# EasyEDA Pro project 鱼缸控制器(e-ink).epro, schematic 控制板原理图
Create Date: 2024-04-12; Page Name: P1; Project Name: 鱼缸控制器(e-ink); Schematic Name: 控制板原理图; Update Date: 2024-05-07; Company: 嘉立创EDA; Page Size: A2; Version: V1.0
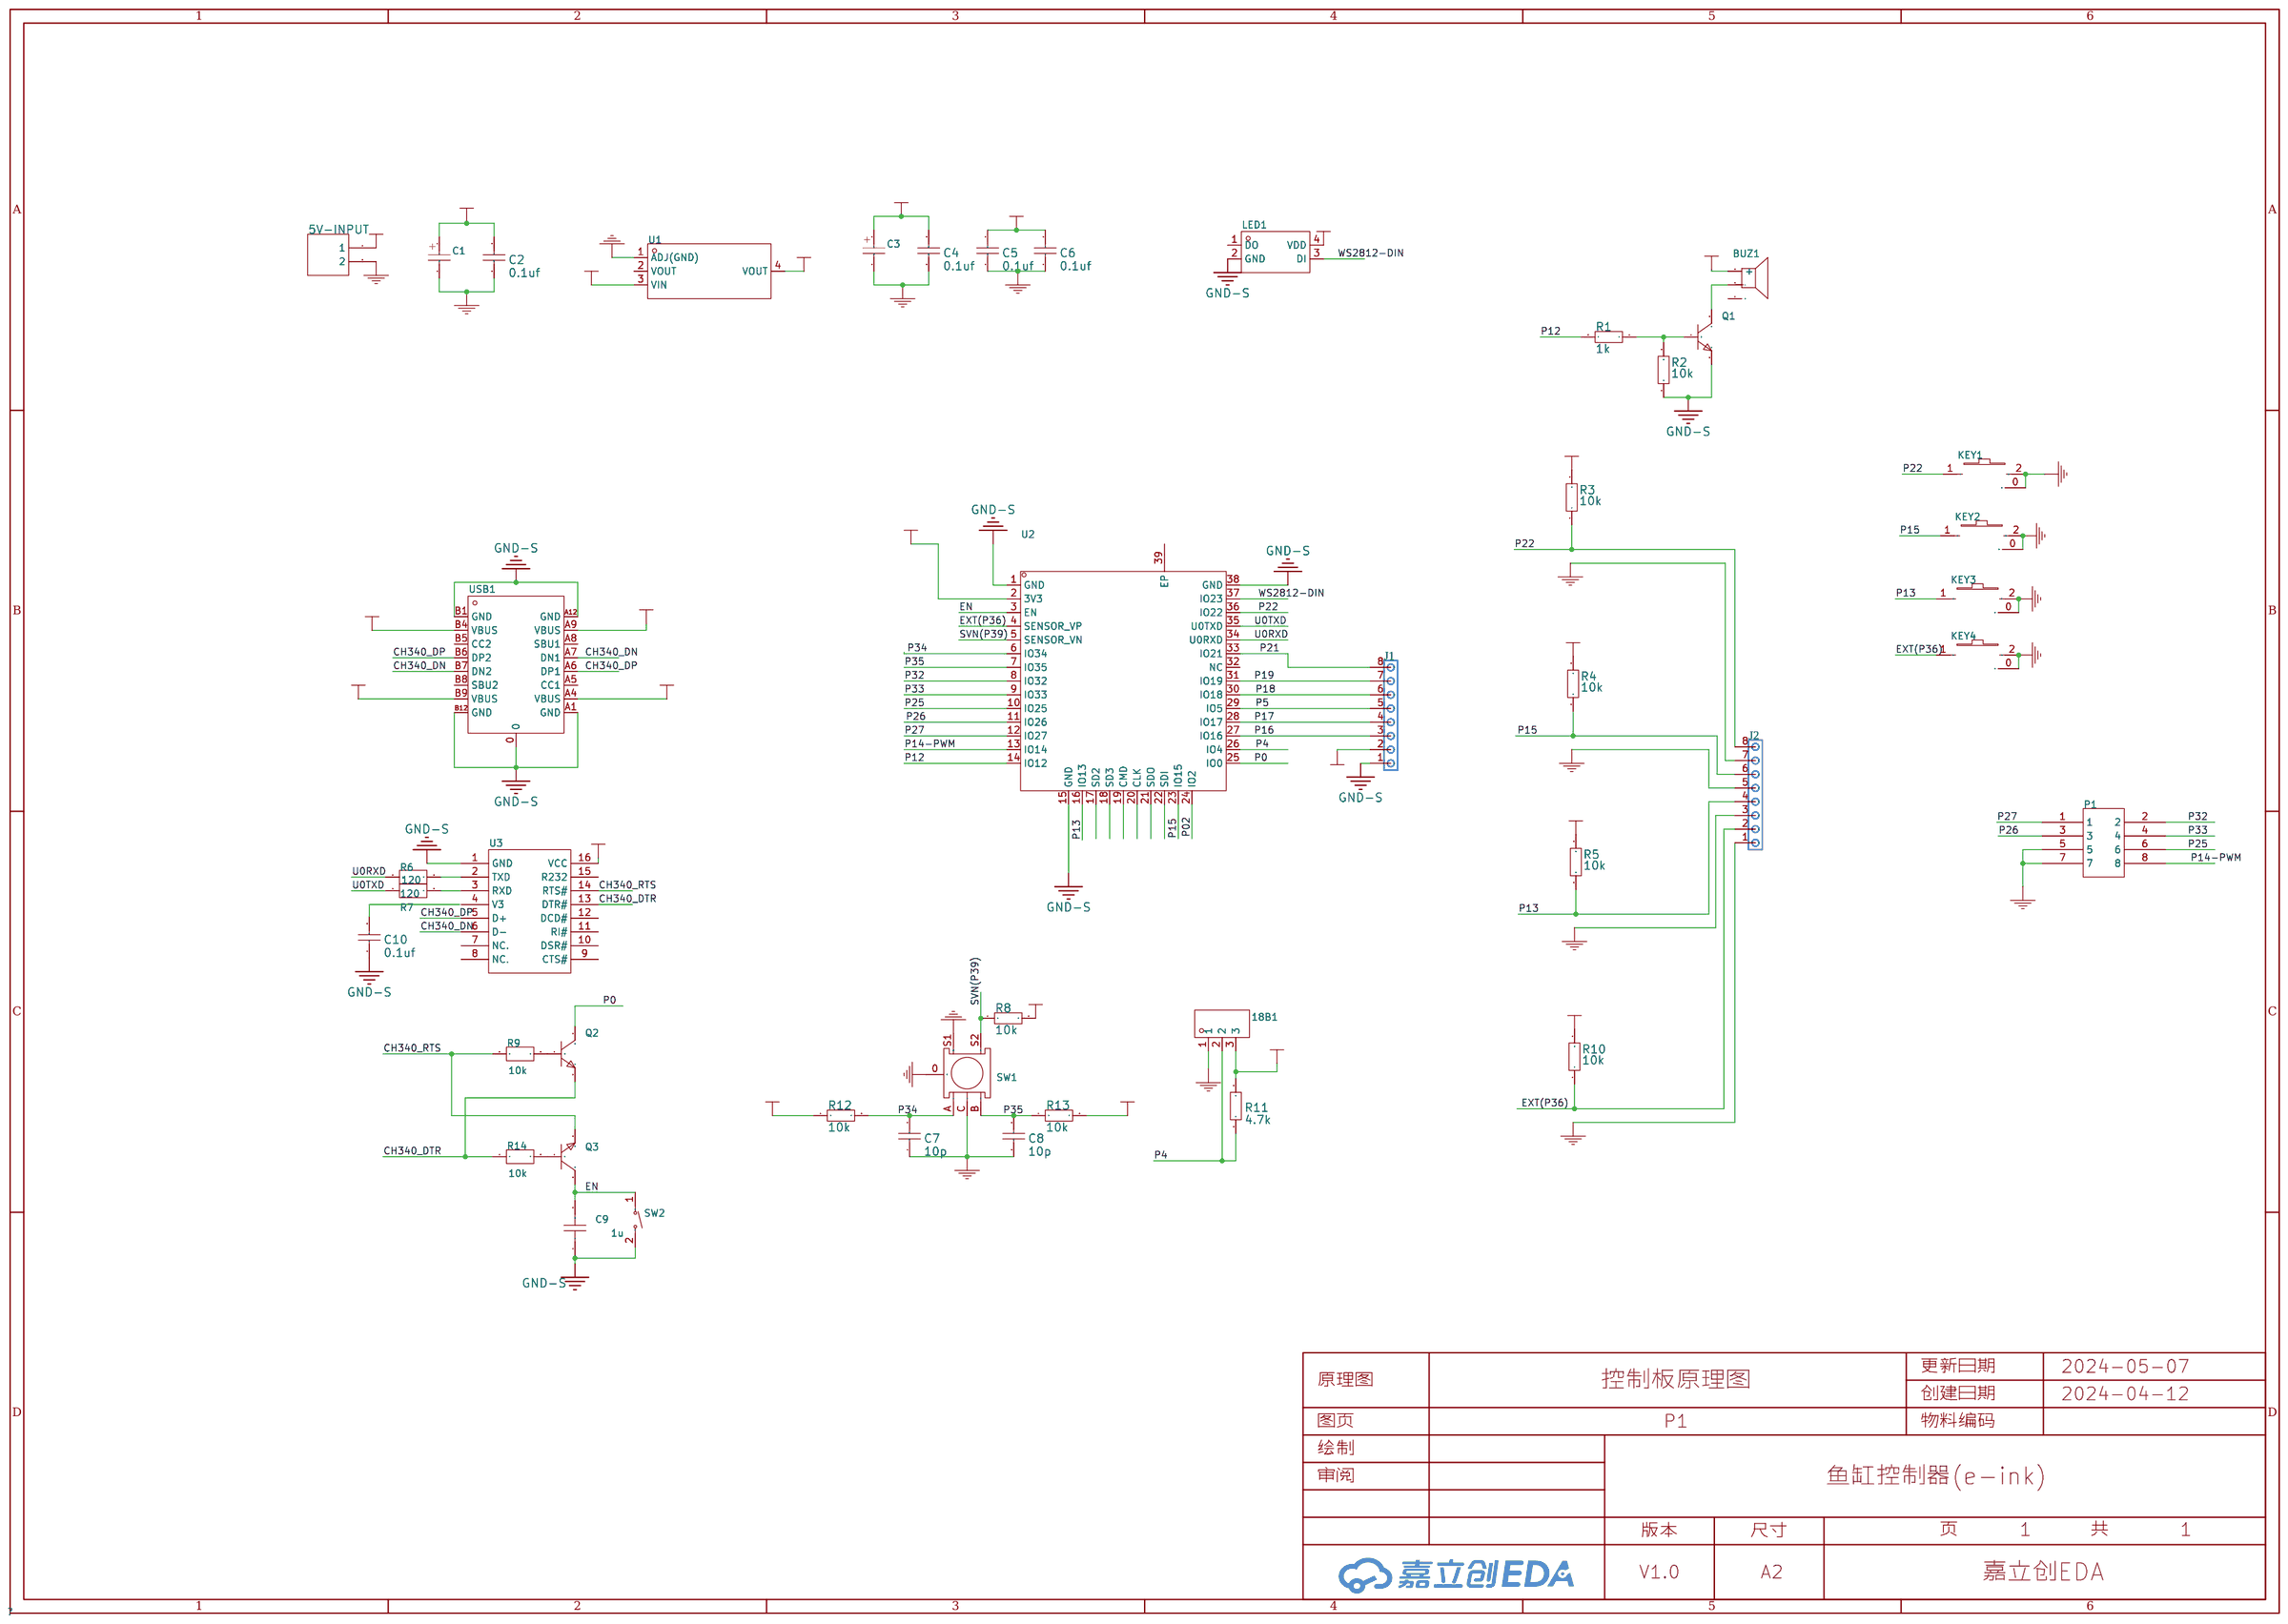
[diagram p1: schematic sheet]

## Parts
5V-INPUT  SIP2  [conn-th_xh2.54-2p]
18B1  3PIN白色直针插座  [CONN-TH_3P-P2.50_3PIN]
BUZ1  5025贴片蜂鸣器  [BUZ-SMD_3P-L5.5-W5.0_5025]
C1  10uF  [CAP-SMD-钽_3216]
C2  0.1uf  [C0805]
C3  10uF  [CAP-SMD-钽_3216]
C4  0.1uf  [C0805]
C5  0.1uf  [C0805]
C6  0.1uf  [C0805]
C7  10p  [C0805]
C8  10p  [C0805]
C9  10uF  [C0805]
C10  0.1uf  [C0805]
J1  单排排针  [CONN-SMD_8P-P1.25_XUNPU_WAFER-MX1.25-8PWB]
J2  单排排针  [CONN-SMD_8P-P1.25_XUNPU_WAFER-MX1.25-8PWB]
KEY1  6*6*4.3 带支架 260g  [KEY-TH_TL1105VF100Q]
KEY2  6*6*4.3 带支架 260g  [KEY-TH_TL1105VF100Q]
KEY3  6*6*4.3 带支架 260g  [KEY-TH_TL1105VF100Q]
KEY4  6*6*4.3 带支架 260g  [KEY-TH_TL1105VF100Q]
LED1  WS2812B-2020  [LED-SMD_4P-L2.0-W2.0-TL_WS2812B-2020]
P1  DC3-8P  [DC3-8P]
Q1  -  [SOT-23-3_L2.9-W1.3-P1.90-LS2.4-BR]
Q2  -  [SOT-23-3_L2.9-W1.3-P1.90-LS2.4-BR]
Q3  -  [SOT-23-3_L2.9-W1.3-P1.90-LS2.4-BR]
R1  1k  [R0805]
R2  10k  [R0805]
R3  10k  [R0805]
R4  10k  [R0805]
R5  10k  [R0805]
R6  120R  [R0805]
R7  120R  [R0805]
R8  10k  [R0805]
R9  10k  [R0805]
R10  10k  [R0805]
R11  4.7k  [R0805]
R12  10k  [R0805]
R13  10k  [R0805]
R14  10k  [R0805]
SW1  EC11S  [SW-TH_EC11S]
SW2  BUTTON2,KEY  [KEY-SMD_L6.0-W3.5-LS8.0]
U1  AMS1117-3.3  [SOT-223-3_L6.5-W3.4-P2.30-LS7.0-BR]
U2  -  [wifim-smd_esp-32s]
U3  -  [SOP-16_L10.0-W3.9-P1.27-LS6.0-BL]
USB1  -  [USB-C_SMD-TYPE-C-31-M-12]

## Library data of the parts
5V-INPUT = SIP2: Manufacturer Part: ?
18B1 = 3PIN白色直针插座: Supplier Part: C9900004958; Supplier Footprint: XH2.54MM; JLCPCB Part Class: 扩展库; Supplier: LCSC
BUZ1 = 5025贴片蜂鸣器: Supplier Part: C9900027059; Supplier Footprint: BUZ-SMD; JLCPCB Part Class: 扩展库; Supplier: LCSC
C1 C3 = 钽电容_3216_A: 容值:10uF;精度:±10%;额定电压:16V;等效串联电阻:3Ω@100kHz;工作温度:-55℃~+125℃;; LCSC Part Name: 10uF ±10% 16V; Supplier Part: C7171; Manufacturer: Kyocera AVX; Manufacturer Part: TAJA106K016RNJ; Supplier Footprint: CASE-A-3216; JLCPCB Part Class: 基础库; Datasheet: https://atta.szlcsc.com/upload/public/pdf/source/20160107/1457707748093.pdf; Supplier: LCSC; Tolerance: ±10%; Rated Voltage: 16V; Equivalent Series Resistance(ESR): 3Ω@100kHz; Operating Temperature: -55℃~+125℃
C2 C4-C8 C10 = 1uf: Capacitor; Manufacturer Part: ?
C9 = CC0805KKX7R7BB106: 容值:10uF;精度:±10%;额定电压:16V;温度系数:X7R;; LCSC Part Name: 10uF ±10% 16V; Supplier Part: C326595; Manufacturer: YAGEO(国巨); LCSC On Sale: 1; Supplier Footprint: 0805; JLCPCB On Sale: 1; Datasheet: https://atta.szlcsc.com/upload/public/pdf/source/20181031/C326595_C62C116A6C3064E30600AA088F316586.pdf; Supplier: LCSC; Tolerance: ±10%; Voltage Rated: 16V; Temperature Coefficient: X7R; JLCPCB Part Class: Extended Part
J1 J2 = 单排排针: 8P接插件; 通识封装: 排针 8P; Origin Footprint 2: HDR-1X8; Origin Footprint 3: HDR-1X8_M; Origin Footprint 4: XH2.54-8P; Origin Footprint 5: VH3.96-8P_H; Origin Footprint 6: VH3.96-8P; Origin Footprint 7: KF2510-8P; Origin Footprint 8: XH2.54-8P_H; Origin Footprint 9: HDR-1X8_Y; Origin Footprint 10: HDR-1X8_H; Origin Footprint 11: KF301-8P; Origin Footprint 12: KF2EDGK5.0-8P; Origin Footprint 13: PH2.0 D-L-8P; Origin Footprint 14: PH2.0 D-W-8P; Origin Footprint 15: KF2EDGK5.0-8P_H; Origin Footprint 16: KF7620-8P; Origin Footprint 17: KF350-8P; Origin Footprint 18: KF128-3.81-8P; Origin Footprint 19: KF128-5.08-8P; Origin Footprint 20: PH2.0 S-W-8P; Origin Footprint 21: KF2EDGK5.08-8P; Origin Footprint 22: KF2EDGK5.08-8P_H; Origin Footprint 23: HDR2.54 S-W-8P; Origin Footprint 24: HDR2.54 S-W-8P_M; Origin Footprint 25: HDR-1X8(Pad_RR_1.4*1.6); Origin Footprint 1: J_排针_2.54_8x1P_SMD_卧贴; Design Item ID: J_Header_8; Library Name: 10.1 排针、排母
KEY1-KEY4 = 6*6*4.3 带支架 260g: LCSC Part Name: 6*6*4.3 带支架  260g; Supplier Part: C3683; Supplier Footprint: 插件; JLCPCB Part Class: 扩展库; Supplier: LCSC
LED1 = WS2812B-2020: 发光颜色:RGB三色;二极管配置:-;透镜颜色:-;主波长:470.4nm；622.5nm；515.6nm;峰值波长:-;色温:-;测试电流:12mA;功率:-;发光角度:-;安装方式:-;工作温度:-;; LCSC Part Name: RGB三色 470.4nm 515.6nm 622.5nm （注意防潮，请查阅规格书中对应具体内容）; Supplier Part: C965555; Manufacturer: worldsemi; Supplier Footprint: SMD,2x2mm; JLCPCB Part Class: Extended Part; Datasheet: https://atta.szlcsc.com/upload/public/pdf/source/20201203/C965555_5C919C4B6231E6ADE06011FB0D94282B.pdf; Supplier: LCSC; Emitted Color: RGB三色; Dominant Wavelength: 470.4nm；622.5nm；515.6nm; Forward Current: 12mA
P1 = DC3-8P: _: 3
Q1-Q3 = SS8050_C2898656: LCSC Part Name: SS8050; Supplier Part: C2898656; Manufacturer: YFW佑风微; Manufacturer Part: SS8050; LCSC On Sale: 1; Supplier Footprint: SOT-23; JLCPCB On Sale: 0; Datasheet: https://atta.szlcsc.com/upload/public/pdf/source/20211008/622629BC07A9A4119D4C274AF7AE621D.pdf; Supplier: LCSC; JLCPCB Part Class: Extended Part
R1-R5 R10 = 4k7: Manufacturer Part: ?
R6 R7 R9 R14 = PTFR0805B232RP9: LCSC Part Name: 232 ±0.1%; Supplier Part: C2849113; Manufacturer: RESI(开步睿思）; LCSC On Sale: 1; Supplier Footprint: 0805; JLCPCB On Sale: 1; Datasheet: https://atta.szlcsc.com/upload/public/pdf/source/20210312/C2692860_0B6649DBA3C867366D8AF92C78953B08.pdf; Supplier: LCSC; JLCPCB Part Class: Extended Part
R8 R12 R13 = 10k: Manufacturer Part: ?
R11 = 4.7k: Manufacturer Part: ?
SW1 = EC11S: Supplier Part: C2895684; Supplier Footprint: 插件; JLCPCB Part Class: 扩展库; Supplier: LCSC
SW2 = BUTTON2,KEY: Supplier Part: C9900020455; JLCPCB Part Class: 扩展库; Supplier: LCSC
U1 = AMS1117-3.3: 输出类型:固定;最大输入电压:18V;输出电压:3.3V;最大输出电流:1A;电源纹波抑制比(PSRR):60dB@(120Hz);输出极性:正极;; LCSC Part Name: 输入18V 输出3.3V 1A; Supplier Part: C2891839; Manufacturer: YONGYUTAI(永裕泰); Supplier Footprint: SOT-223-3; JLCPCB Part Class: 扩展库; Datasheet: https://atta.szlcsc.com/upload/public/pdf/source/20210901/A75ADDE6A17DEE0002F2A58A8D1F3634.pdf; Supplier: LCSC; Output Type: 固定; Maximum Input Voltage: 18V; Output Voltage: 3.3V; MAX Output Current: 1A; Power Supply Rejection Ratio (PSRR): 60dB@(120Hz); Dropout Voltage: 1.3V@(1A); standby current: 5mA; Noise: 0.005%Vout; Operating Temperature: -40℃~+125℃@(Tj); Output Polarity: 正极; Number of Outputs: 1
U2 = ESP32-S_1: LCSC Part Name: ESP32-S; Supplier Part: C277944; Manufacturer: Ai-Thinker(安信可); Manufacturer Part: ESP32-S; LCSC On Sale: 1; Supplier Footprint: SMD Module; JLCPCB On Sale: 1; Datasheet: https://atta.szlcsc.com/upload/public/pdf/source/20180906/C277944_74A290DBC2785A9356A78158C15DB62B.pdf; Supplier: LCSC; JLCPCB Part Class: Extended Part
U3 = CH340C: 类型:Transceiver;协议类别:USB 2.0;驱动器/接收器数:-;数据速率:2Mbps;; Supplier Part: C84681; Manufacturer: WCH(南京沁恒); LCSC On Sale: 1; Supplier Footprint: SOP-16_150mil; JLCPCB On Sale: 1; Datasheet: https://atta.szlcsc.com/upload/public/pdf/source/20200819/C84681_ADBED554CE321879DBD6B1D06488689C.pdf; Supplier: LCSC; Type: Transceiver; Protocol: USB 2.0; Data Rate: 2Mbps; Supply Voltage: 3.3V, 5V; JLCPCB Part Class: Extended Part
USB1 = USB-TYPE-C-018: Supplier Part: C2927038; Manufacturer: DEALON(德艺隆); LCSC On Sale: 1; Supplier Footprint: 插件; JLCPCB On Sale: 0; Datasheet: https://atta.szlcsc.com/upload/public/pdf/source/20211217/CCD3D517E355E8E0CC52ABD8D5784AD8.pdf; Supplier: LCSC

## Nets
+3.3V: 18B1.3 C3.1 C4.2 C5.2 C6.2 J1.2 R3.2 R4.2 R5.2 R8.2 R10.2 R11.2 R12.1 R13.2 U1.4(VOUT) U2.2(3V3) U3.16(VCC)
+5V: 5V-INPUT.1 BUZ1.2(+) C1.1 C2.2 LED1.4(VDD) U1.3(VIN) USB1.A4(VBUS) USB1.A9(VBUS) USB1.B4(VBUS) USB1.B9(VBUS)
GND-S: 5V-INPUT.2 18B1.1 C1.2 C2.1 C3.2 C4.1 C5.1 C6.1 C7.1 C8.1 C9.1 C10.1 J1.1 J2.1 J2.3 J2.5 J2.7 KEY1.0 KEY1.2 KEY2.0 KEY2.2 KEY3.0 KEY3.2 KEY4.0 KEY4.2 LED1.2(GND) P1.5 P1.7 Q1.2(E) R2.1 SW1.0 SW1.C SW1.S1 SW2.2 U1.1(ADJ(GND)) U2.1(GND) U2.15(GND) U2.38(GND) U3.1(GND) USB1.0 USB1.A1(GND) USB1.A12(GND) USB1.B1(GND) USB1.B12(GND)
CH340_DN: U3.6(D-) USB1.A7(DN1) USB1.B7(DN2)
CH340_DP: U3.5(D+) USB1.A6(DP1) USB1.B6(DP2)
CH340_DTR: Q2.2(E) R14.1 U3.13(DTR#)
CH340_RTS: Q3.2(E) R9.1 U3.14(RTS#)
EN: C9.2 Q3.3(C) SW2.1 U2.3(EN)
EXT(P36): J2.2 KEY4.1 R10.1 U2.4(SENSOR_VP)
P0: Q2.3(C) U2.25(IO0)
P02: U2.24(IO2)
P4: 18B1.2 R11.1 U2.26(IO4)
P5: J1.5 U2.29(IO5)
P12: R1.2 U2.14(IO12)
P13: J2.4 KEY3.1 R5.1 U2.16(IO13)
P14-PWM: P1.8 U2.13(IO14)
P15: J2.6 KEY2.1 R4.1 U2.23(IO15)
P16: J1.3 U2.27(IO16)
P17: J1.4 U2.28(IO17)
P18: J1.6 U2.30(IO18)
P19: J1.7 U2.31(IO19)
P21: J1.8 U2.33(IO21)
P22: J2.8 KEY1.1 R3.1 U2.36(IO22)
P25: P1.6 U2.10(IO25)
P26: P1.3 U2.11(IO26)
P27: P1.1 U2.12(IO27)
P32: P1.2 U2.8(IO32)
P33: P1.4 U2.9(IO33)
P34: C7.2 R12.2 SW1.A U2.6(IO34)
P35: C8.2 R13.1 SW1.B U2.7(IO35)
SVN(P39): R8.1 SW1.S2 U2.5(SENSOR_VN)
U0RXD: R6.1 U2.34(U0RXD)
U0TXD: R7.1 U2.35(U0TXD)
WS2812-DIN: LED1.3(DI) U2.37(IO23)
$1N3073: R6.2 U3.2(TXD)
$1N3074: R7.2 U3.3(RXD)
$1N3352: Q2.1(B) R9.2
$1N3353: Q3.1(B) R14.2
$1N21870: Q1.1(B) R1.1 R2.2
$1N21896: BUZ1.3(-) Q1.3(C)

Not connected (* = marked no-connect by the designer): BUZ1 1; C10 2; LED1 1(DO); U1 2(VOUT); U2 17(SD2) 18(SD3) 19(CMD) 20(CLK) 21(SDO) 22(SDI) 32(NC) 39(EP); U3 4(V3) 7(NC.) 8(NC.) 9(CTS#) 10(DSR#) 11(RI#) 12(DCD#) 15(R232); USB1 A5(CC1) A8(SBU1) B5(CC2) B8(SBU2)
